# Altium project PCB_Project.PrjPcb
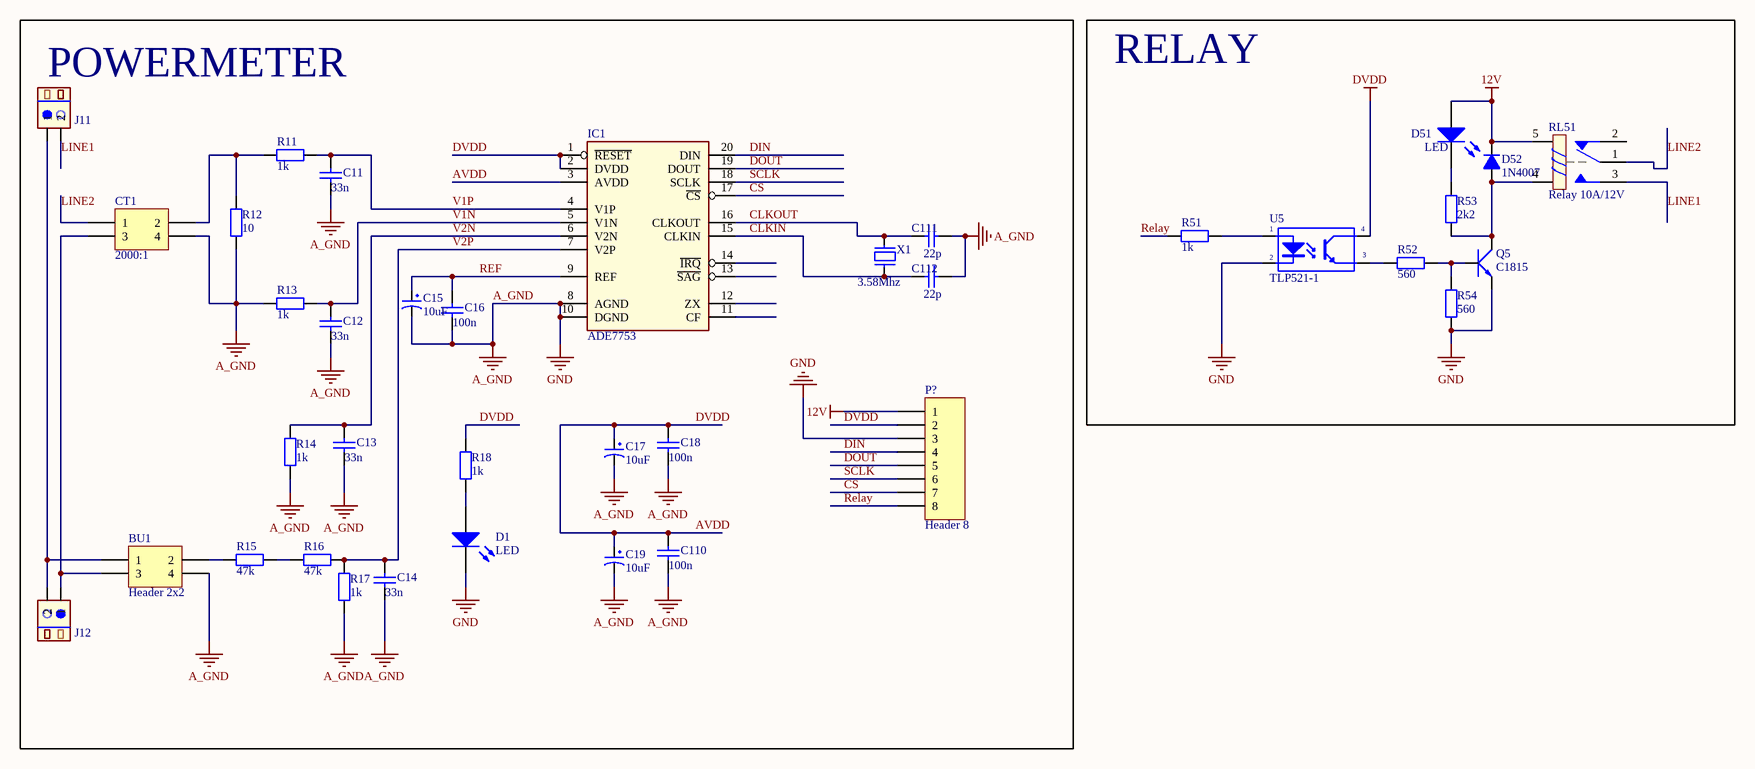
[diagram p0: Slave_ver1.SchDoc]
1 sheet, 37 parts. Net scope: global (net labels, ports and power ports of the same name join across sheets).
Board file: Slave_ver1.PcbDoc

## Sheet Slave_ver1.SchDoc
size A3

### Parts
BU1  Header 2x2  [BU]
C11  value 33n  [CAP_SMD_0805]  (hidden comment: Capacitor Ceramic)
C12  value 33n  [CAP_SMD_0805]  (hidden comment: Capacitor Ceramic)
C13  value 33n  [CAP_SMD_0805]  (hidden comment: Capacitor Ceramic)
C14  value 33n  [CAP_SMD_0805]  (hidden comment: Capacitor Ceramic)
C15  10uF  [CP1/2]
C16  value 100n  [CAP_SMD_0805]  (hidden comment: Capacitor Ceramic)
C17  10uF  [CP1/2]
C18  value 100n  [CAP_SMD_0805]  (hidden comment: Capacitor Ceramic)
C19  10uF  [CP1/2]
C110  value 100n  [CAP_SMD_0805]  (hidden comment: Capacitor Ceramic)
C111  value 22p  [CAP_SMD_0805]  (hidden comment: Capacitor Ceramic)
C112  value 22p  [CAP_SMD_0805]  (hidden comment: Capacitor Ceramic)
CT1  2000:1  [BI]
D1  LED  [LED-0 5mm RED]
D51  LED  [LED-0 5mm RED]
D52  1N4007  [D1A]
IC1  ADE7753  [ADE7753_Header]
J11  CON.Domino2  [DOMINO 2B]  (value not drawn)
J12  CON.Domino2  [DOMINO 2B]  (value not drawn)
P?  Header 8  [Header 8]
Q5  C1815  [QTO-92]
R11  value 1k  [DIEN TRO 0805]  (hidden comment: RES_SMD_0805)
R12  value 10  [DIEN TRO 0805]  (hidden comment: RES_SMD_0805)
R13  value 1k  [DIEN TRO 0805]  (hidden comment: RES_SMD_0805)
R14  value 1k  [DIEN TRO 0805]  (hidden comment: RES_SMD_0805)
R15  value 47k  [DIEN TRO 0805]  (hidden comment: RES_SMD_0805)
R16  value 47k  [DIEN TRO 0805]  (hidden comment: RES_SMD_0805)
R17  value 1k  [DIEN TRO 0805]  (hidden comment: RES_SMD_0805)
R18  value 1k  [DIEN TRO 0805]  (hidden comment: RES_SMD_0805)
R51  value 1k  [DIEN TRO 0805]  (hidden comment: RES_SMD_0805)
R52  value 560  [DIEN TRO 0805]  (hidden comment: RES_SMD_0805)
R53  value 2k2  [DIEN TRO 0805]  (hidden comment: RES_SMD_0805)
R54  value 560  [DIEN TRO 0805]  (hidden comment: RES_SMD_0805)
RL51  Relay 10A/12V  [RL_SPDT_10A]
U5  TLP521-1  [DIP4/W0.3]
X1  3.58Mhz  [XT2]

### Blocks framed on the sheet
POWERMETER: BU1 C11-C19 C110-C112 CT1 D1 IC1 J11 J12 P? R11-R18 X1
RELAY: D51 D52 Q5 R51-R54 RL51 U5

### Nets
12V: D51.1(A) D52.2(K) P?.1 RL51.5
A_GND: BU1.4 C11.1 C12.1 C13.1 C14.1 C15.2 C16.1 C17.2 C18.1 C19.2 C110.1 C111.1 C112.1 CT1.4 D1.2(K) IC1.8(AGND) IC1.10(DGND) P?.3 Q5.1(E) R12.1 R13.2 R14.1 R17.1 R54.2 U5.2(K)  [also labelled GND]
AVDD: C17.1 C18.2 C19.1 C110.2 IC1.1(~{RESET}) IC1.2(DVDD) IC1.3(AVDD) P?.2 R18.2 U5.4(C)  [also labelled DVDD]
CLKIN: C112.2 IC1.15(CLKIN) X1.1
CLKOUT: C111.2 IC1.16(CLKOUT) X1.2
CS: IC1.17(~{CS}) P?.7
DIN: IC1.20(DIN) P?.4
DOUT: IC1.19(DOUT) P?.5
LINE1: J11.2 RL51.3
LINE2: CT1.1 RL51.1
REF: C15.1 C16.2 IC1.9(REF)
Relay: P?.8 R51.2
SCLK: IC1.18(SCLK) P?.6
V1N: C12.2 IC1.5(V1N) R13.1
V1P: C11.2 IC1.4(V1P) R11.1
V2N: C13.2 IC1.6(V2N) R14.2
V2P: C14.2 IC1.7(V2P) R16.1 R17.2
NetBU1_1: BU1.1 J11.1 J12.2
NetBU1_2: BU1.2 R15.2
NetBU1_3: BU1.3 CT1.3 J12.1
NetCT1_2: CT1.2 R11.2 R12.2
NetD1_1: D1.1(A) R18.1
NetD51_2: D51.2(K) R53.1
NetD52_1: D52.1(A) Q5.2(C) R53.2 RL51.4
NetQ5_3: Q5.3(B) R52.1 R54.1
NetR15_1: R15.1 R16.2
NetR51_1: R51.1 U5.1(A)
NetR52_2: R52.2 U5.3(E)

Not connected (* = marked no-connect by the designer): IC1 11(CF) 12(ZX) 13(~{SAG}) 14(~{IRQ}); RL51 2

### Library data of the parts
BU1 CT1 = Header 2x2: Header, 4-Pin, 2-Row; LatestRevisionDate: 17-Jul-2002; LatestRevisionNote: Re-released for DXP Platform.; Publisher: Altium Limited
C11-C14 C16 C18 C110-C112 = CapSMD: Capacitor; Published: 8-Jun-2000; LatestRevisionDate: 17-Jul-2002; LatestRevisionNote: Re-released for DXP Platform.; PackageReference: RAD-0.3; Publisher: Altium Limited
C15 C17 C19 = CP1: Cap P  0,1uF < 22uF , 16 - 50V; Value: 10uF/50V; Description 1: 10 => 220uF/6,3V/10V - 10uF => 100uF/16V; Description 2: 0,1uF => 33uF/50V - 10uF => 22uF/63V; Description 3: 0,47uF => 10uF/100V
D1 D51 = LED: Typical LED; Published: 8-Jun-2000; LatestRevisionDate: 08-Jul-2005; LatestRevisionNote: Mech Layer 1 removed.; PackageReference: LED-1; Publisher: Altium Limited
D52 = D1A: Diode 1A; Value: 1N4007
IC1 = ADE7753: Single-Phase Multifunction Metering IC with di/dt Sensor Interface
J11 J12 = CON.Domino2: 2 pins Domino Header; Publisher: Hoang Nguyen; ComponentLink1Description: Digikey Part link; ComponentLink2Description: Open DataSheet; ComponentLink2URL: H:\LIBRARY\LIBRARY.Datasheet\; Price: 2000VND
P? = Header 8: Header, 8-Pin; LatestRevisionDate: 17-Jul-2002; LatestRevisionNote: Re-released for DXP Platform.; Publisher: Altium Limited
Q5 = C1815: NPN 600mW, ECB; Value: C1815
R11-R18 R51-R54 = RES_SMD_0805: RES_0805; Published: 8-Jun-2000; LatestRevisionDate: 17-Jul-2002; LatestRevisionNote: Re-released for DXP Platform.; PackageReference: AXIAL-0.4; Publisher: Altium Limited
RL51 = Relay 1: Relay SPDT,10A - 12VDC 5 Pin; Value: Relay SPDT, 10A, 12V
U5 = TLP521-1: Single Opto; Value: TLP5211
X1 = XT2: Crystal For all Crystal 2pin.; Value: 4Mhz